# EAGLE design interface (EAGLE 6.1)

## Sheet 1 of 3
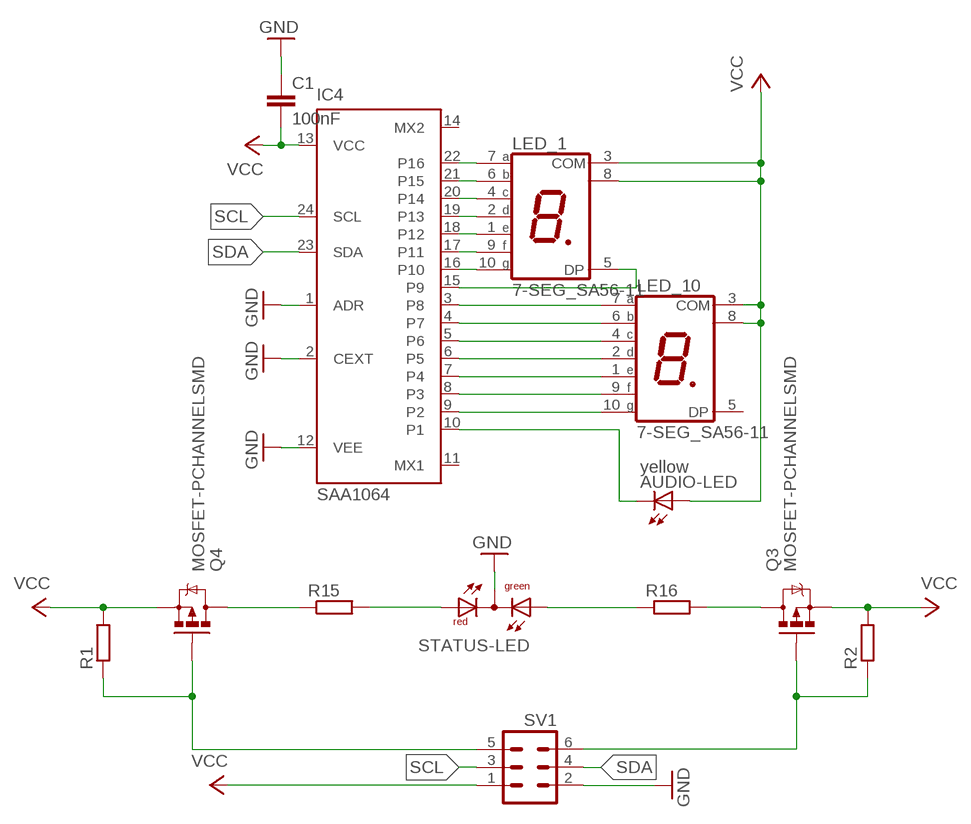
[diagram p0: schematic, sheet 1]

### Parts
AUDIO-LED  yellow  LED10MM  [LED10MM]
C1  100nF  C-EUC1206  [C1206]
IC4  SAA1064  [DIL24-6]
LED_1  7-SEG_SA56-11  [SA56-11]
LED_10  7-SEG_SA56-11  [SA56-11]
Q3  MOSFET-PCHANNELSMD  [SOT23-3]
Q4  MOSFET-PCHANNELSMD  [SOT23-3]
R1  R-EU_R1206  [R1206]
R2  R-EU_R1206  [R1206]
R15  R-EU_R1206  [R1206]
R16  R-EU_R1206  [R1206]
STATUS-LED  DUOLED-RG-C  [DUOLED-C-5MM]
SV1  ML6SMD2  [ML6_SMD2]

### Nets
GND: C1.1 IC4.1(ADR) IC4.2(CEXT) IC4.12(VEE) STATUS-LED.C SV1.2
N$1: IC4.17(P11) LED_1.9(F)
N$2: IC4.19(P13) LED_1.2(D)
N$3: IC4.21(P15) LED_1.6(B)
N$4: IC4.22(P16) LED_1.7(A)
N$5: IC4.20(P14) LED_1.4(C)
N$6: IC4.18(P12) LED_1.1(E)
N$7: IC4.16(P10) LED_1.10(G)
N$8: IC4.15(P9) LED_1.5(DP)
N$9: AUDIO-LED.K(C) IC4.10(P1)
N$10: IC4.3(P8) LED_10.7(A)
N$11: IC4.4(P7) LED_10.6(B)
N$12: IC4.5(P6) LED_10.4(C)
N$13: IC4.6(P5) LED_10.2(D)
N$14: IC4.7(P4) LED_10.1(E)
N$15: IC4.8(P3) LED_10.9(F)
N$16: IC4.9(P2) LED_10.10(G)
N$23: Q4.3(D) R15.1
N$24: Q3.3(D) R16.2
N$29: R15.2 STATUS-LED.AR
N$30: R16.1 STATUS-LED.AX(AG)
SCL: IC4.24(SCL) SV1.3
SDA: IC4.23(SDA) SV1.4
STATUS_GREEN: Q3.1(G) R2.1 SV1.6
STATUS_RED: Q4.1(G) R1.1 SV1.5
VCC: AUDIO-LED.A C1.2 IC4.13(VCC) LED_1.3(COM) LED_1.8(COM) LED_10.3(COM) LED_10.8(COM) Q3.2(S) Q4.2(S) R1.2 R2.2 SV1.1
Unconnected: IC4.11(MX1) IC4.14(MX2) LED_10.5(DP)

## Sheet 2 of 3
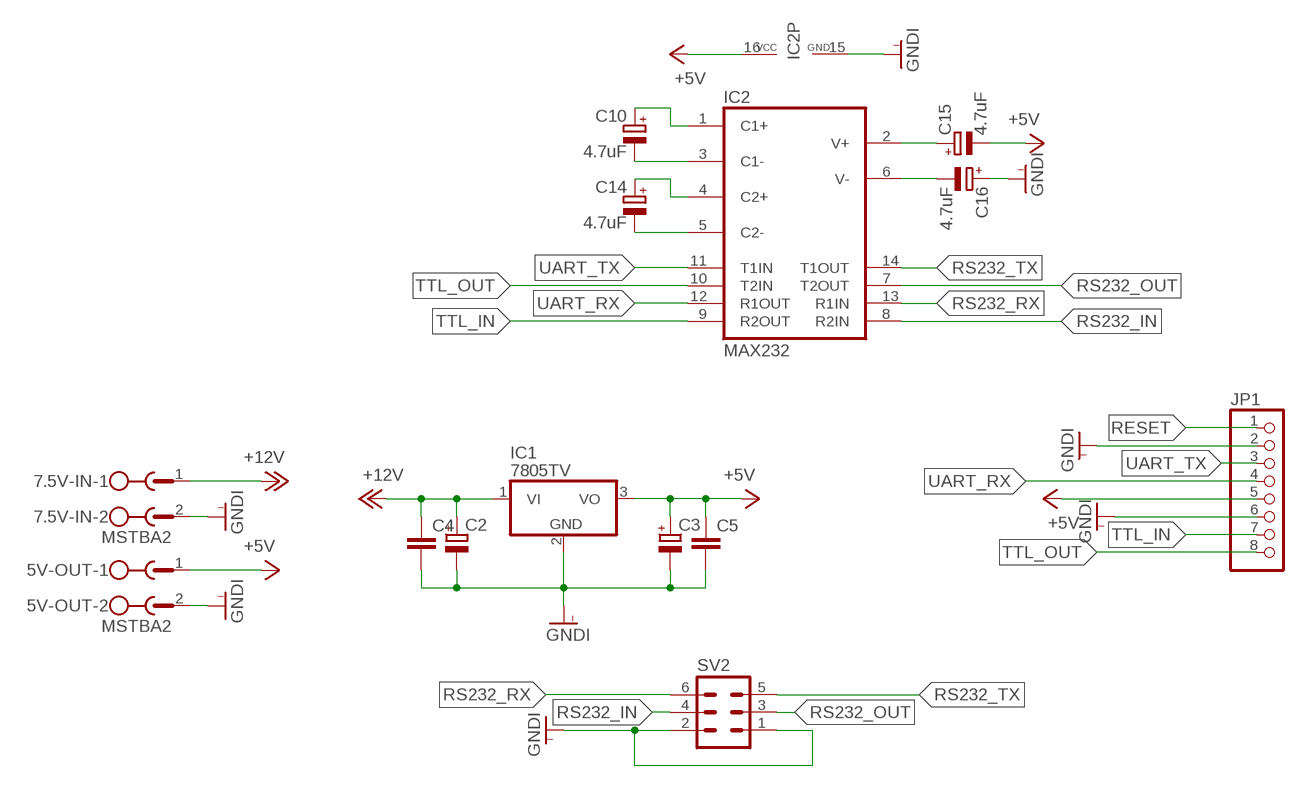
[diagram p1: schematic, sheet 2]

### Parts
5V-OUT  MSTBA2  [MSTBA2]
7.5V-IN  MSTBA2  [MSTBA2]
C2  CPOL-EUE5-10.5  [E5-10,5]
C3  CPOL-EUE5-10.5  [E5-10,5]
C4  C-EUC1206  [C1206]
C5  C-EUC1206  [C1206]
C10  4.7uF  CPOL-EUE2-5  [E2-5]
C14  4.7uF  CPOL-EUE2-5  [E2-5]
C15  4.7uF  CPOL-EUE2-5  [E2-5]
C16  4.7uF  CPOL-EUE2-5  [E2-5]
IC1  7805TV  [TO220V]
IC2  MAX232  [DIL16]
JP1  PINHD-1X8/90  [1X08/90]
SV2  ML6  [ML6]

### Nets
+5V: 5V-OUT.1 C3.+ C5.1 C15.- IC1.3(VO) IC2.16(VCC) JP1.5
+12V: 7.5V-IN.1 C2.+ C4.1 IC1.1(VI)
GNDI: 5V-OUT.2 7.5V-IN.2 C2.- C3.- C4.2 C5.2 C16.+ IC1.2(GND) IC2.15(GND) JP1.2 JP1.6 SV2.1 SV2.2
N$17: C14.+ IC2.4(C2+)
N$18: C14.- IC2.5(C2-)
N$19: C10.- IC2.3(C1-)
N$20: C10.+ IC2.1(C1+)
N$21: C16.- IC2.6(V-)
N$22: C15.+ IC2.2(V+)
RESET: JP1.1
RS232_IN: IC2.8(R2IN) SV2.4
RS232_OUT: IC2.7(T2OUT) SV2.3
RS232_RX: IC2.13(R1IN) SV2.6
RS232_TX: IC2.14(T1OUT) SV2.5
TTL_IN: IC2.9(R2OUT) JP1.7
TTL_OUT: IC2.10(T2IN) JP1.8
UART_RX: IC2.12(R1OUT) JP1.4
UART_TX: IC2.11(T1IN) JP1.3

## Sheet 3 of 3
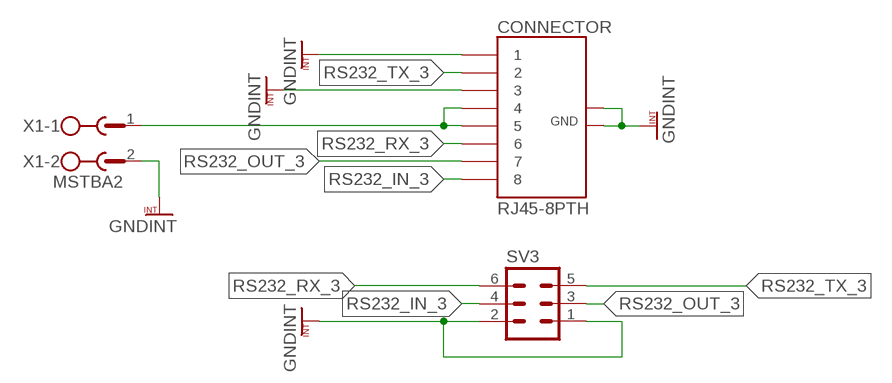
[diagram p2: schematic, sheet 3]

### Parts
CONNECTOR  RJ45-8PTH  [RJ45-8]
SV3  ML6  [ML6]
X1  MSTBA2  [MSTBA2]

### Nets
GNDINT: CONNECTOR.1 CONNECTOR.3 CONNECTOR.GND_1 CONNECTOR.GND_2 SV3.1 SV3.2 X1.2
RS232_IN_3: CONNECTOR.8 SV3.4
RS232_OUT_3: CONNECTOR.7 SV3.3
RS232_RX_3: CONNECTOR.6 SV3.6
RS232_TX_3: CONNECTOR.2 SV3.5
V_BAT: CONNECTOR.4 CONNECTOR.5 X1.1

## Library data of the parts
5V-OUT 7.5V-IN X1 = con-phoenix-508:MSTBA2: PHOENIX; MF: FARNELL; MPN: 1757242; OC_FARNELL: 3705171; OC_NEWARK: 71C4161
AUDIO-LED = led:LED: LED OSRAM: - CHIPLED LG R971, LG N971, LY N971, LG Q971, LY Q971, LO R971, LY R971 LH N974, LH R974 LS Q976, LO Q976, LY Q976 LO Q996 - Hyper CHIPLED LW Q18S LB Q993, LB Q99A, LB R99A - SideLED LS A670, LO A670, LY A670, LG A670, LP A670 LB A673, LV A673, LT A673, LW A673 LH A674 LY A675 LS A676, LA A676, LO A676, LY A676, LW A676 LS A679, LY A679, LG A679 - Hyper Micro SIDELED® LS Y876, LA Y876, LO Y876, LY Y876 LT Y87S - SmartLED LW L88C, LW L88S LB L89C, LB L89S, LG L890 LS L89K, LO L89K, LY L89K LS L896, LA L896, LO L896, LY L896 - TOPLED LS T670, LO T670, LY T670, LG T670, LP T670 LSG T670, LSP T670, LSY T670, LOP T670, LYG T670 LG T671, LOG T671, LSG T671 LB T673, LV T673, LT T673, LW T673 LH T674 LS T676, LA T676, LO T676, LY T676, LB T676, LH T676, LSB T676, LW T676 LB T67C, LV T67C, LT T67C, LS T67K, LO T67K, LY T67K, LW E67C LS E67B, LA E67B, LO E67B, LY E67B, LB E67C, LV E67C, LT E67C LW T67C LS T679, LY T679, LG T679 LS T770, LO T770, LY T770, LG T770, LP T770 LB T773, LV T773, LT T773, LW T773 LH T774 LS E675, LA E675, LY E675, LS T675 LS T776, LA T776, LO T776, LY T776, LB T776 LHGB T686 LT T68C, LB T68C - Hyper Mini TOPLED® LB M676 - Mini TOPLED Santana® LG M470 LS M47K, LO M47K, LY M47K Source: http://www.osram.convergy.de LUXEON: - LUMILED® LXK2-PW12-R00, LXK2-PW12-S00, LXK2-PW14-U00, LXK2-PW14-V00 LXK2-PM12-R00, LXK2-PM12-S00, LXK2-PM14-U00 LXK2-PE12-Q00, LXK2-PE12-R00, LXK2-PE12-S00, LXK2-PE14-T00, LXK2-PE14-U00 LXK2-PB12-K00, LXK2-PB12-L00, LXK2-PB12-M00, LXK2-PB14-N00, LXK2-PB14-P00, LXK2-PB14-Q00 LXK2-PR12-L00, LXK2-PR12-M00, LXK2-PR14-Q00, LXK2-PR14-R00 LXK2-PD12-Q00, LXK2-PD12-R00, LXK2-PD12-S00 LXK2-PH12-R00, LXK2-PH12-S00 LXK2-PL12-P00, LXK2-PL12-Q00, LXK2-PL12-R00 Source: www.luxeon.com KINGBRIGHT: KA-3528ASYC Source: www.kingbright.com
C1 C4 C5 = resistor:C-EU: CAPACITOR, European symbol
C2 C3 C10 C14-C16 = resistor:CPOL-EU: POLARIZED CAPACITOR, European symbol
CONNECTOR = ShortCircuitRobotics:RJ45-8: RJ45 Jack Simple RJ45, 8-pin connection - connector for common Cat5, Cat5e, and Cat6 Ethernet cables. Footprint not yet proven in production. Connector sku is PRT-00643; Breakout PCB sku is BOB-00716.
IC1 = linear:78*: Positive VOLTAGE REGULATOR Source: http://cache.national.com/ds/LM/LM78L05.pdf http://www.fairchildsemi.com/ds/LM/LM7805.pdf
IC2 = maxim:MAX232: RS232 TRANSEIVER; MF: MAXIM; MPN: MAX232ACPE+; OC_FARNELL: 9723773; OC_NEWARK: 68K4544
IC4 = micro-philips:SAA1064: I2C-Bus 4-digit LED-DRIVER; MPN: SAA1064/N2,112; OC_FARNELL: 1627002; OC_NEWARK: 70R8646
JP1 = pinhead:PINHD-1X8: PIN HEADER
LED_1 LED_10 = display-kingbright:7-SEG_: Kingbright 14.2mm (0.56 INCH) SINGLE DIGIT NUMERIC DUISPLAY Source: SA56-11EWA(Ver1189471036.pdf; OC_FARNELL: unknown; OC_NEWARK: unknown
Q3 Q4 = SparkFun:MOSFET-PCHANNEL
R1 R2 R15 R16 = resistor:R-EU_: RESISTOR, European symbol
STATUS-LED = led:DUOLED-RG-C: DUO LED 2 colors (red/green), 5 mm, round, common Cathode www.ligitek.com or other producers.
SV1 = ShortCircuitRobotics:ML6: HARTING
SV2 SV3 = con-harting-ml:ML6: HARTING; OC_FARNELL: unknown; OC_NEWARK: unknown

## Board
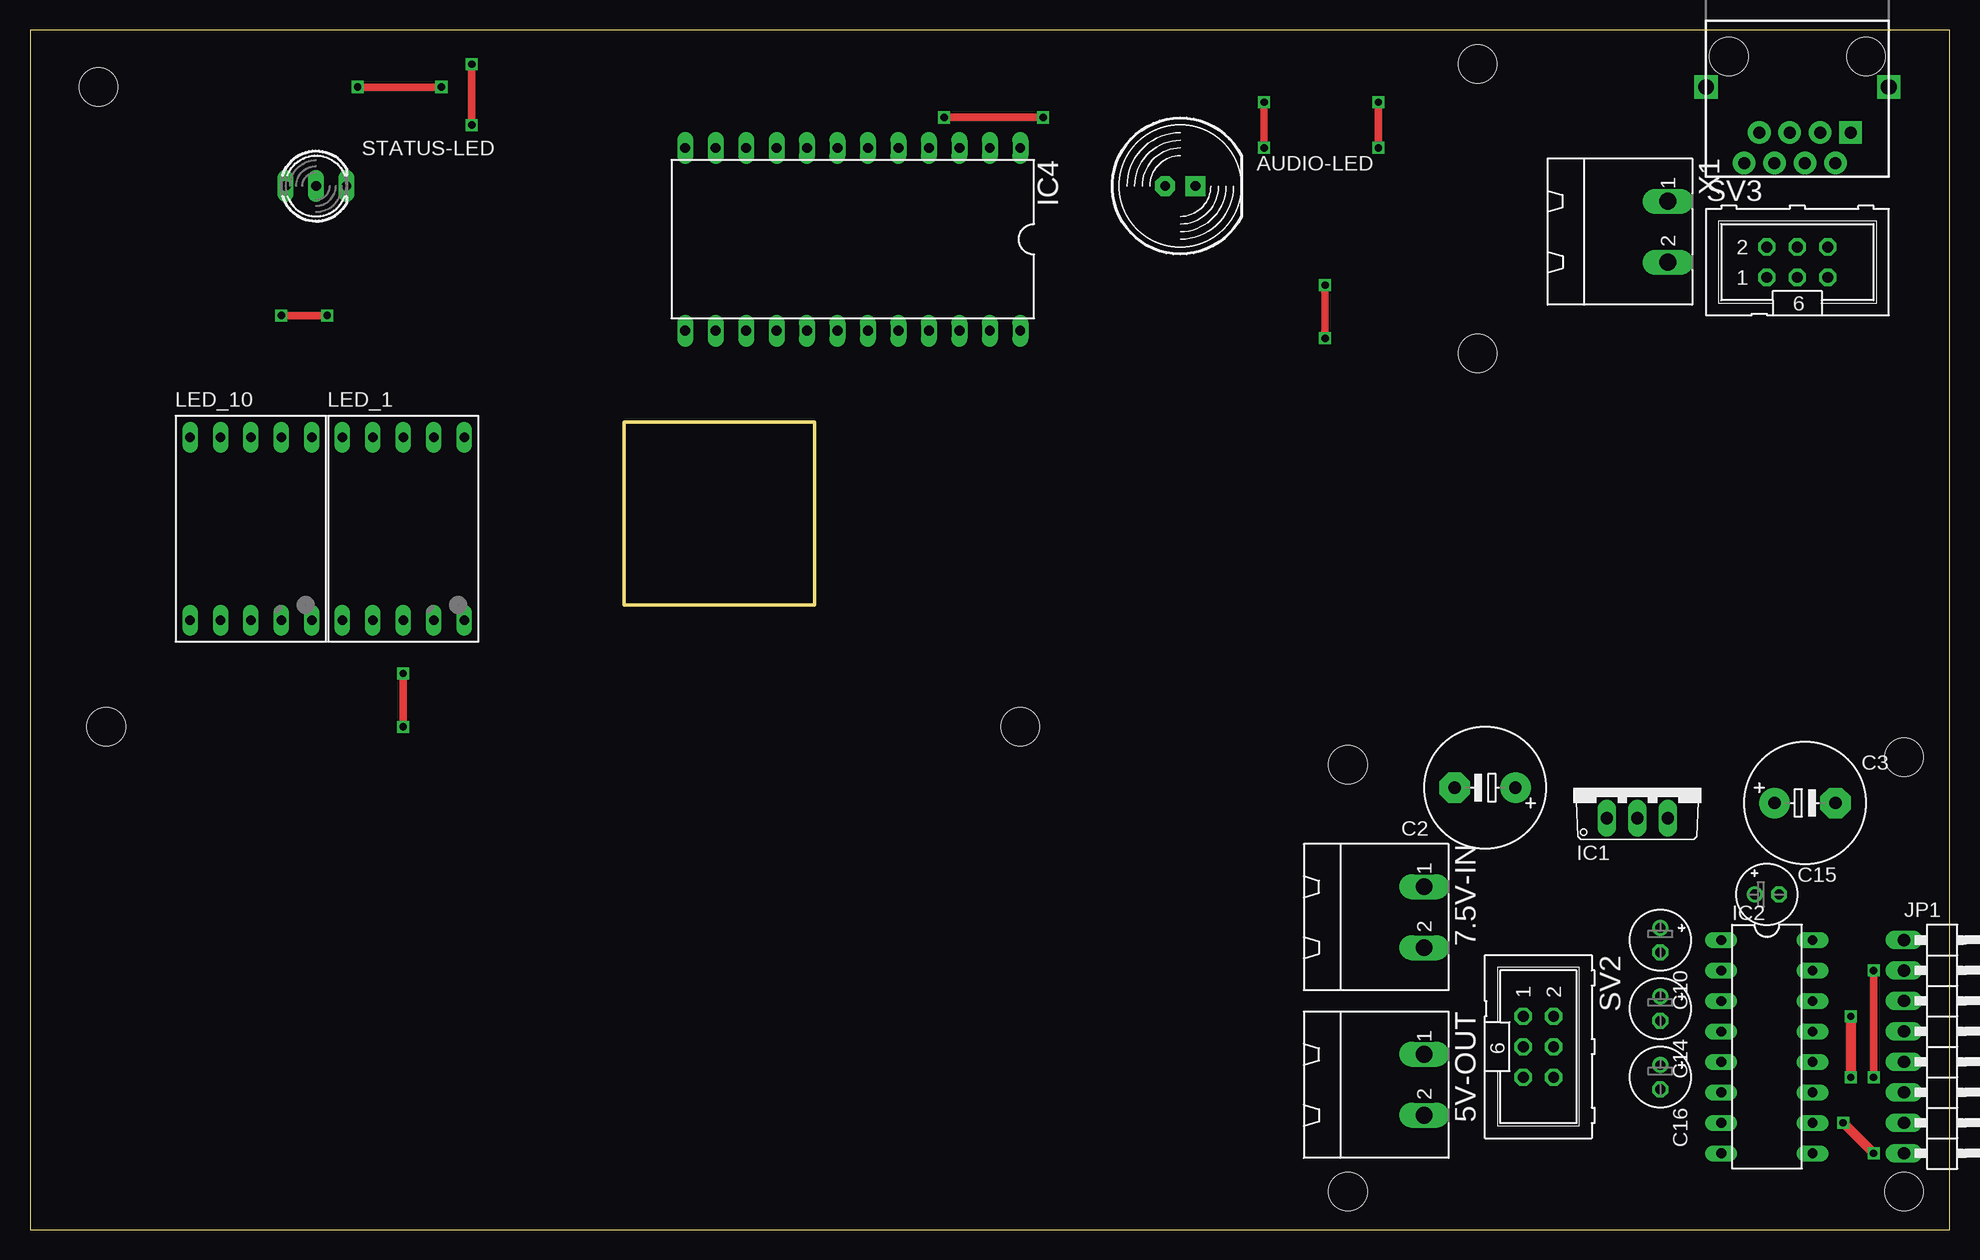
[diagram p3: board, top side]
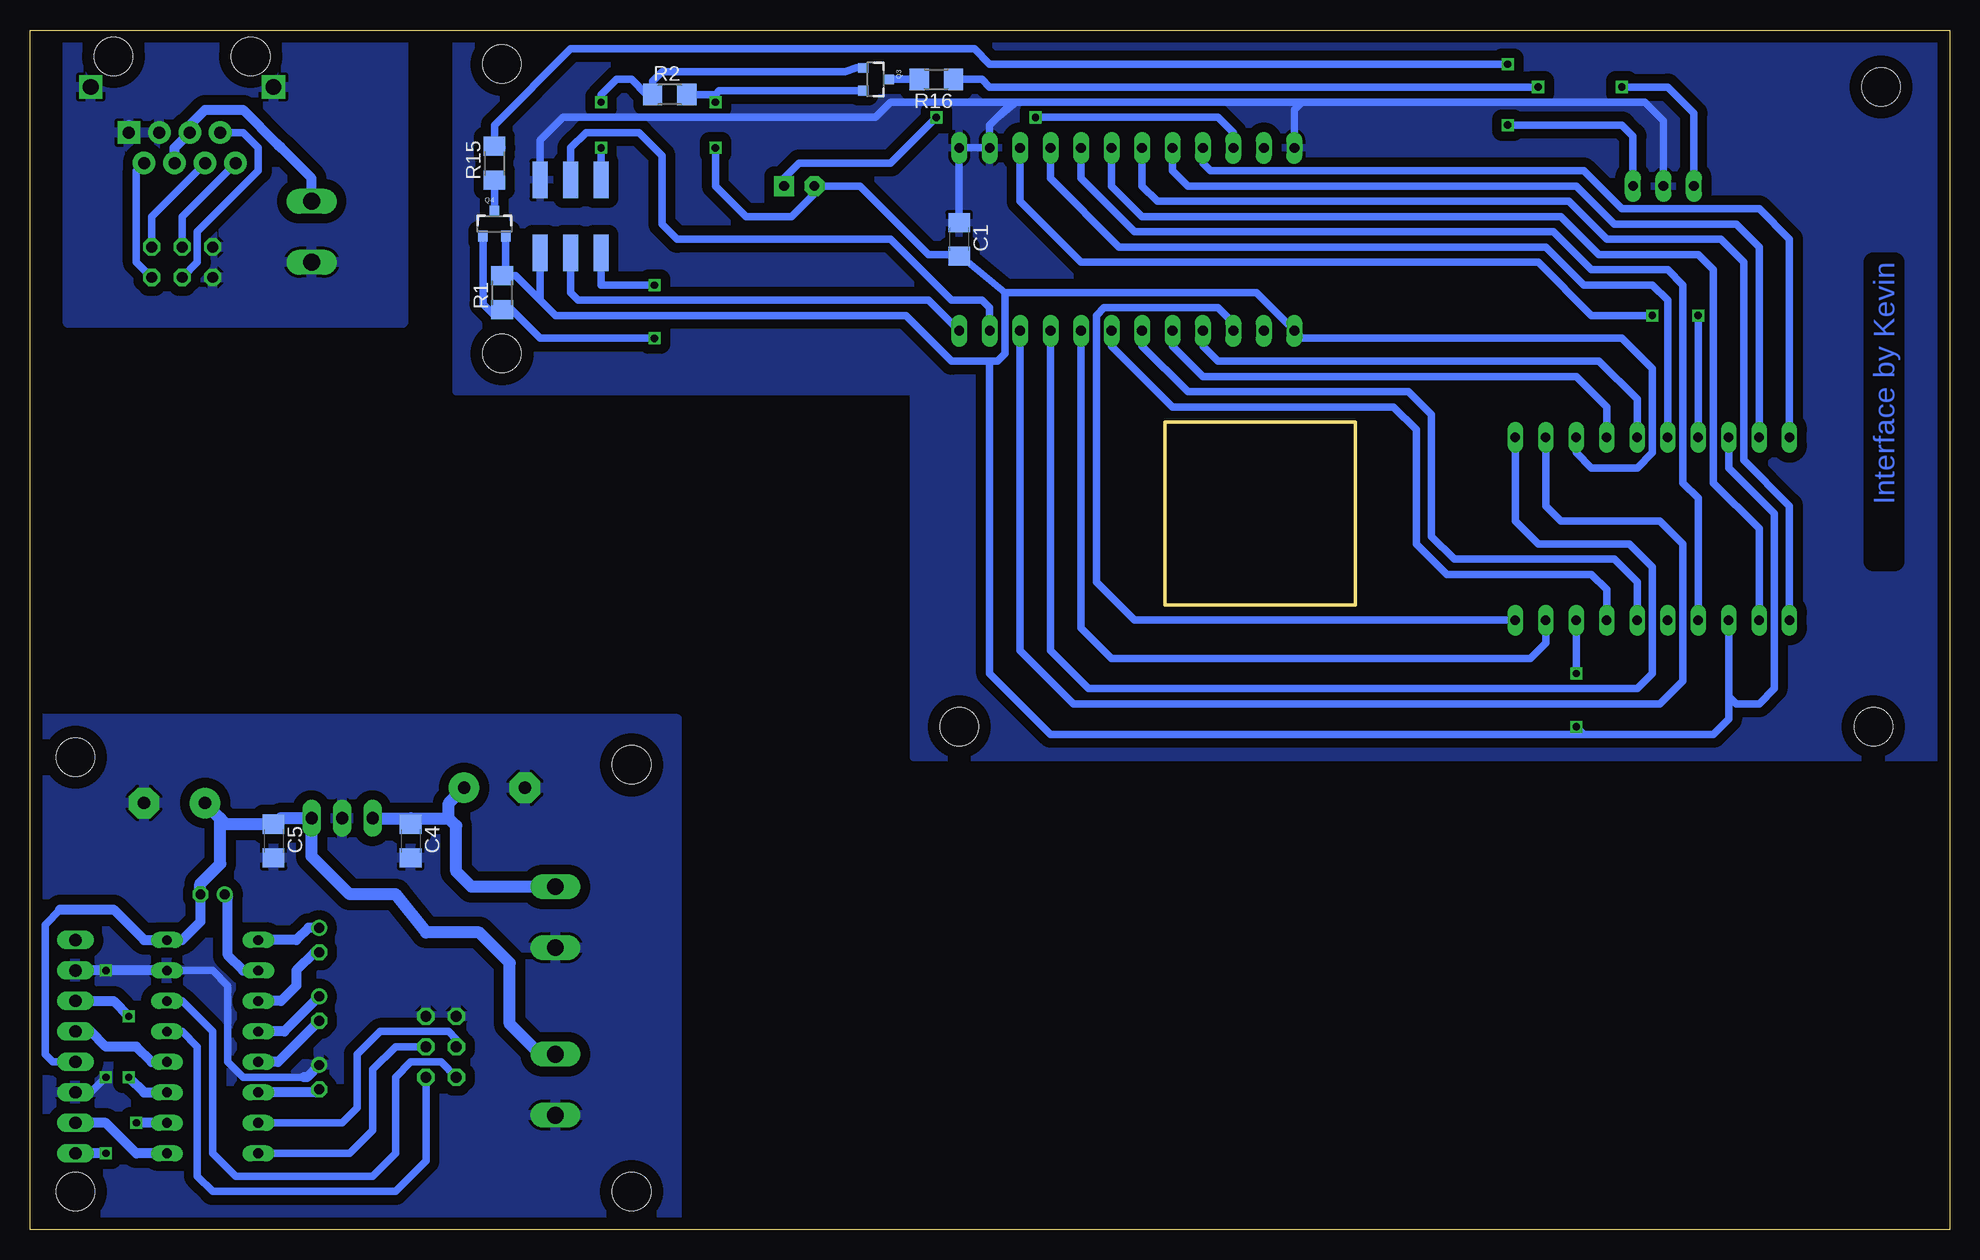
[diagram p4: board, bottom side, seen from below]

Size 160 x 100 mm. Coordinates in mm from the lower left corner, seen from the top.
Outline: 0,0 160,0 160,100 0,100 0,0
Copper layers (1*16): Top 0.035mm / dielectric 1.5mm / Bottom 0.035mm
Design rules: minimum track width 10mil, minimum drill 24mil, track to track 8mil, track to pad 8mil, pad to pad 8mil, via to via 8mil, smd to smd 8mil, copper to edge 40mil, drill to drill 8mil, minimum pad ring 10mil, minimum via ring 8mil, stop-mask expansion 4mil, vias tented up to drill 0mil, thermal gap 10mil
Holes 3.2 mm at 109.86,38.73 156.21,39.37 156.21,3.17 109.86,3.17 5.71,95.25 6.35,41.91 82.55,41.91 120.65,97.16 120.65,73.03
Milling: 4 lines

### Footprints (pad centres in the part's own frame; a part is rotated, then mirrored left to right if it is on the bottom)
MSTBA2 = drill 1.397 long: 1 -2.54,5.08; 2 2.54,5.08
LED10MM = drill 0.813 pad 1.676 octagon: A -1.27,0 | drill 0.813 pad 1.676 square: K 1.27,0
C1206 = smd 1.6 x 1.8: 1 -1.4,0; 2 1.4,0
E5-10,5 = drill 1.016 pad 2.54: + -2.54,0 | drill 1.016 pad 2.54 octagon: - 2.54,0
E2-5 = drill 0.813 pad 1.27: + -1.016,0 | drill 0.813 pad 1.27 octagon: - 1.016,0
RJ45-8 = drill 1 pad 1.88 square: 1 -4.445,6.35 | drill 1 pad 1.88: 2 -3.175,8.89; 3 -1.905,6.35; 4 -0.635,8.89; 5 0.635,6.35; 6 1.905,8.89; 7 3.175,6.35; 8 4.445,8.89 | drill 1.3 square: GND_1 -7.62,2.54; GND_2 7.62,2.54 | hole 3.2: -5.715,0; 5.715,0
TO220V = drill 1.016 long: 1 -2.54,-2.54; 2 0,-2.54; 3 2.54,-2.54
DIL16 = drill 0.813 long: 1 -8.89,-3.81; 2 -6.35,-3.81; 3 -3.81,-3.81; 4 -1.27,-3.81; 5 1.27,-3.81; 6 3.81,-3.81; 7 6.35,-3.81; 8 8.89,-3.81; 9 8.89,3.81; 10 6.35,3.81; 11 3.81,3.81; 12 1.27,3.81; 13 -1.27,3.81; 14 -3.81,3.81; 15 -6.35,3.81; 16 -8.89,3.81
DIL24-6 = drill 0.813 long: 1 -13.97,-7.62; 2 -11.43,-7.62; 3 -8.89,-7.62; 4 -6.35,-7.62; 5 -3.81,-7.62; 6 -1.27,-7.62; 7 1.27,-7.62; 8 3.81,-7.62; 9 6.35,-7.62; 10 8.89,-7.62; 11 11.43,-7.62; 12 13.97,-7.62; 13 13.97,7.62; 14 11.43,7.62; 15 8.89,7.62; 16 6.35,7.62; 17 3.81,7.62; 18 1.27,7.62; 19 -1.27,7.62; 20 -3.81,7.62; 21 -6.35,7.62; 22 -8.89,7.62; 23 -11.43,7.62; 24 -13.97,7.62
1X08/90 = drill 1.016 long: 1 -8.89,-3.81; 2 -6.35,-3.81; 3 -3.81,-3.81; 4 -1.27,-3.81; 5 1.27,-3.81; 6 3.81,-3.81; 7 6.35,-3.81; 8 8.89,-3.81
SA56-11 = drill 0.8 long: 1 -5.08,-7.62; 2 -2.54,-7.62; 3 0,-7.62; 4 2.54,-7.62; 5 5.08,-7.62; 6 5.08,7.62; 7 2.54,7.62; 8 0,7.62; 9 -2.54,7.62; 10 -5.08,7.62
SOT23-3 = smd 0.8 x 0.9: 1 -0.95,-1; 2 0.95,-1; 3 0,1.1
R1206 = smd 1.6 x 1.803: 1 -1.422,0; 2 1.422,0
DUOLED-C-5MM = drill 0.813 long: AR 2.54,0; AX -2.54,0; C 0,0
ML6_SMD2 = smd 1.27 x 3.048: 1 -2.54,-3.048; 2 -2.54,3.048; 3 0,-3.048; 4 0,3.048; 5 2.54,-3.048; 6 2.54,3.048
ML6 = drill 0.914 octagon: 1 -2.54,-1.27; 2 -2.54,1.27; 3 0,-1.27; 4 0,1.27; 5 2.54,-1.27; 6 2.54,1.27

### Placement (x,y rotation side)
5V-OUT  111.12,12.06 270 top
7.5V-IN  111.12,26.04 270 top
AUDIO-LED  95.89,87 0 top
C1  82.55,82.55 270 bottom
C2  121.28,36.83 180 top
C3  147.96,35.56 0 top
C4  128.27,32.38 270 bottom
C5  139.7,32.38 270 bottom
C10  135.89,24.13 270 top
C14  135.89,18.41 270 top
C15  144.78,27.94 0 top
C16  135.89,12.7 270 top
CONNECTOR  147.32,97.79 180 top
IC1  133.99,36.83 0 top
IC2  144.78,15.24 270 top
IC4  68.58,82.55 180 top
JP1  160.02,15.24 270 top
LED_1  31.11,58.42 0 top
LED_10  18.41,58.42 0 top
Q3  89.53,95.89 270 bottom
Q4  121.28,83.82 0 bottom
R1  120.65,78.11 90 bottom
R2  106.68,94.61 0 bottom
R15  121.28,88.9 90 bottom
R16  84.45,95.89 180 bottom
STATUS-LED  23.84,87 0 top
SV1  114.94,84.45 0 bottom
SV2  125.73,15.24 270 top
SV3  147.32,80.64 0 top
X1  131.44,83.19 270 top

### Tracks (layer width: path | path; a pad name or v marks a point on that pad's centre or on a via)
+5V
  Bottom 0.61: JP1.5 158.12,13.97 158.75,14.61 158.75,25.4 157.48,26.67
  Bottom 0.813: C15.- 145.8,25.65 147.32,24.13 IC2.16 150.5,24.13 153.03,26.67 157.48,26.67
  Bottom 1.016: 5V-OUT.1 117.47,14.61 120.02,17.14 120.02,22.23 122.56,24.77 127,24.77 129.54,27.94 133.35,27.94 136.53,31.11 IC1.3 139.06,34.29 139.7,33.66 C5.1 143.64,33.78 144.15,34.29 | C15.- 145.8,28.83 144.15,30.48 144.15,34.29 | 144.15,34.29 C3.+
+12V
  Bottom 1.016: 7.5V-IN.1 123.19,28.57 124.46,29.84 124.46,33.66 125.09,34.29 | IC1.1 128.27,34.29 | 128.27,34.29 125.09,34.29 | C4.1 128.27,34.29 | 125.09,34.29 125.09,35.56 C2.+
GND
  Bottom 0.61: C1.1 IC4.1 IC4.2 80.01,92.08 79.69,92.39 | STATUS-LED.C 23.84,92.42 25.4,93.98 53.98,93.98 | 53.98,93.98 54.61,93.34 IC4.12 | 79.69,92.39 78.11,93.98 | 78.11,93.98 77.79,93.98 | 77.79,93.98 53.98,93.98 | SV1.2 117.47,90.81 115.57,92.71 89.53,92.71 88.27,93.98 78.11,93.98 | 77.79,93.98 79.69,92.39
  pour Bottom (isolate 0.813): 0,100.33 124.46,100.33 124.46,69.85 86.36,69.85 86.36,39.37 0,39.37
GNDI  (via drill 0.6)
  Top 0.61: v153.67,12.7 v153.67,21.59
  Bottom 0.61: 137.16,12.7 142.24,12.7 143.51,13.97 143.51,20.32 144.78,21.59 IC2.15 | JP1.6 154.94,11.43 v153.67,12.7
  Bottom 0.813: C16.+ 136.91,12.7 137.16,12.7 | IC2.15 v153.67,21.59 JP1.2
  pour Bottom (isolate 0.813): 106.05,0 106.05,42.55 160.02,42.55 160.02,0
GNDINT
  Bottom 0.813: CONNECTOR.1 151.76,92.08
  pour Bottom (isolate 0.813): 128.91,99.69 128.91,75.56 156.84,75.56 156.84,99.69
N$1
  Bottom 0.61: IC4.17 64.77,73.66 62.23,71.12 31.11,71.12 28.57,68.58 LED_1.9
N$2
  Bottom 0.61: LED_1.2 28.57,53.34 29.84,54.61 41.91,54.61 44.45,57.15 44.45,66.67 46.35,68.58 64.77,68.58 69.85,73.66 IC4.19
N$3
  Bottom 0.61: LED_1.6 36.2,59.05 34.29,57.15 26.67,57.15 24.77,55.24 24.77,46.35 26.04,45.09 71.75,45.09 74.93,48.26 IC4.21
N$4
  Bottom 0.61: IC4.22 77.47,48.26 73.98,44.77 73.66,44.45 73.03,43.81 24.13,43.81 22.23,45.72 22.23,57.15 24.13,59.05 32.38,59.05 33.66,60.33 LED_1.7
N$5
  Bottom 0.61: LED_1.4 33.66,48.9 34.92,47.62 69.85,47.62 72.39,50.16 IC4.20
N$6
  Bottom 0.61: LED_1.1 26.04,53.98 27.94,55.88 41.27,55.88 43.18,57.78 43.18,67.94 45.09,69.85 63.5,69.85 67.31,73.66 IC4.18
N$7
  Bottom 0.61: LED_1.10 26.04,69.22 29.21,72.39 60.96,72.39 62.23,73.66 IC4.16
N$8
  Bottom 0.61: LED_1.5 67.94,50.8 71.12,53.98 71.12,76.2 70.48,76.83 60.96,76.83 59.69,75.56 IC4.15
N$9  (via drill 0.6)
  Top 0.61: v76.2,92.71 v84.45,92.71
  Bottom 0.61: IC4.10 59.69,91.44 60.96,92.71 v76.2,92.71 | v84.45,92.71 88.27,88.9 95.89,88.9 97.16,87.63 AUDIO-LED.K
N$10  (via drill 0.6)
  Top 0.61: v20.95,76.2 v24.77,76.2
  Bottom 0.61: LED_10.7 v20.95,76.2 | IC4.3 77.47,85.72 72.39,80.64 34.29,80.64 29.84,76.2 v24.77,76.2
N$11
  Bottom 0.61: LED_10.6 23.5,77.47 24.77,78.74 30.48,78.74 33.66,81.92 69.22,81.92 74.93,87.63 IC4.4
N$12
  Bottom 0.61: LED_10.4 20.95,60.96 22.23,62.23 22.23,78.74 23.5,80.01 29.84,80.01 33.02,83.19 67.94,83.19 72.39,87.63 IC4.5
N$13
  Bottom 0.61: LED_10.2 15.88,58.42 19.68,62.23 19.68,80.01 20.95,81.28 29.21,81.28 32.38,84.45 67.31,84.45 69.85,87 IC4.6
N$14
  Bottom 0.61: LED_10.1 13.34,60.33 17.14,64.14 17.14,80.64 19.05,82.55 28.57,82.55 31.75,85.72 66.04,85.72 67.31,87 IC4.7
N$15
  Bottom 0.61: IC4.8 64.77,88.27 63.5,87 31.11,87 27.94,83.82 17.78,83.82 15.88,81.92 LED_10.9
N$16
  Bottom 0.61: IC4.9 62.23,88.9 61.59,88.27 30.48,88.27 27.3,85.09 15.88,85.09 13.34,82.55 LED_10.10
N$17
  Bottom 0.813: C14.+ 138.81,16.51 IC2.4
N$18
  Bottom 0.813: C14.- 139.32,13.97 IC2.5
N$19
  Bottom 0.813: IC2.3 139.06,19.05 137.79,20.32 137.79,21.59 136.27,23.11 C10.-
N$20
  Bottom 0.813: C10.+ 136.78,25.15 137.79,24.13 IC2.1
N$21
  Bottom 0.813: C16.- 136.14,11.43 IC2.6
N$22
  Bottom 0.813: IC2.2 142.24,21.59 143.51,22.86 143.51,27.69 C15.+
N$23
  Bottom 0.61: Q4.3 R15.1 121.28,87.63
N$24
  Bottom 0.61: R16.2 Q3.3
N$29  (via drill 0.6)
  Top 0.61: v36.83,92.08 v36.83,97.16
  Bottom 0.61: STATUS-LED.AR 26.39,91.16 27.3,92.08 v36.83,92.08 | v36.83,97.16 80.01,97.16 81.28,98.42 114.94,98.42 121.28,92.08 R15.2 120.65,90.17
N$30  (via drill 0.6)
  Top 0.61: v34.29,95.25 v27.3,95.25
  Bottom 0.61: STATUS-LED.AX 21.3,93.06 23.5,95.25 v27.3,95.25 | R16.1 80.64,95.89 80.01,95.25 v34.29,95.25
RS232_IN
  Bottom 0.61: IC2.8 133.35,6.35 131.44,8.26 131.44,13.34 129.54,15.24 SV2.4
RS232_IN_3
  Bottom 0.61: SV3.4 147.32,84.45 CONNECTOR.8
RS232_OUT
  Bottom 0.61: SV2.3 124.46,15.88 125.09,16.51 130.81,16.51 132.72,14.61 132.72,10.16 133.99,8.89 IC2.7
RS232_OUT_3
  Bottom 0.61: SV3.3 146.05,80.64 146.05,83.19 140.97,88.27 140.97,90.17 142.24,91.44 CONNECTOR.7
RS232_RX
  Bottom 0.61: IC2.13 147.32,16.51 146.05,15.24 146.05,4.45 144.78,3.17 129.54,3.17 127,5.71 SV2.6
RS232_RX_3
  Bottom 0.61: SV3.6 149.86,84.45 CONNECTOR.6
RS232_TX
  Bottom 0.61: IC2.14 147.32,19.05 144.78,16.51 144.78,6.35 142.88,4.45 131.44,4.45 129.54,6.35 129.54,12.7 128.27,13.97 125.73,13.97 SV2.5
RS232_TX_3
  Bottom 0.61: SV3.5 151.13,80.64 151.13,88.27 CONNECTOR.2
SCL
  Bottom 0.61: SV1.3 114.94,78.11 114.3,77.47 85.09,77.47 IC4.24
SDA
  Bottom 0.61: IC4.23 80.01,76.83 80.64,77.47 83.19,77.47 88.27,82.55 106.05,82.55 107.31,83.82 107.31,89.53 109.22,91.44 113.67,91.44 114.94,90.17 SV1.4
STATUS_GREEN  (via drill 0.6)
  Top 0.61: v112.39,90.17 v112.39,93.98
  Bottom 0.61: SV1.6 v112.39,90.17 | v112.39,93.98 112.39,94.61 111.12,95.89 109.86,95.89 108.58,94.61 R2.1 108.1,95.73 107.31,96.52 92.08,96.52 91.12,96.83 Q3.1
STATUS_RED  (via drill 0.6)
  Top 0.61: v107.95,74.3 v107.95,78.74
  Bottom 0.61: Q4.1 122.23,77.15 121.28,76.2 121.13,76.2 R1.1 119.86,76.68 117.47,74.3 v107.95,74.3 | v107.95,78.74 112.39,78.74 SV1.5
TTL_IN
  Bottom 0.813: IC2.9 151.13,6.35 153.67,8.89 JP1.7
TTL_OUT  (via drill 0.6)
  Top 0.813: v151.13,8.89 v153.67,6.35
  Bottom 0.813: IC2.10 v151.13,8.89 | v153.67,6.35 JP1.8
UART_RX
  Bottom 0.813: IC2.12 149.86,13.97 151.13,15.24 153.67,15.24 154.94,16.51 JP1.4
UART_TX  (via drill 0.6)
  Top 0.813: v151.76,17.78 v151.76,12.7
  Bottom 0.813: JP1.3 153.03,19.05 v151.76,17.78 | v151.76,12.7 150.5,11.43 IC2.11
V_BAT
  Bottom 0.813: CONNECTOR.4 147.96,90.17 CONNECTOR.5 146.69,92.08 145.41,93.34 142.24,93.34 139.38,90.49 139.06,90.17 136.53,87.63 X1.1
VCC  (via drill 0.6)
  Top 0.61: v31.11,41.91 v31.11,46.35 | v102.87,90.17 v102.87,93.98
  Bottom 0.61: LED_1.8 31.11,64.77 29.84,63.5 26.04,63.5 24.77,64.77 24.77,71.75 27.3,74.3 53.98,74.3 IC4.13 57.78,78.11 78.74,78.11 | LED_10.3 18.41,44.45 | 30.48,41.27 19.68,41.27 18.41,42.55 18.41,44.45 | 30.48,41.27 v31.11,41.91 | v31.11,46.35 LED_1.3 | 78.74,78.11 82.55,81.28 | 80.01,72.39 79.38,72.39 78.74,73.03 78.74,78.11 | LED_10.8 18.41,63.5 14.61,59.69 14.61,45.09 15.88,43.81 17.78,43.81 18.41,44.45 | 30.48,41.27 74.93,41.27 80.01,46.35 80.01,72.39 | 82.55,81.28 85.09,81.28 90.81,87 AUDIO-LED.A 94.61,86.36 96.52,84.45 100.33,84.45 102.87,87 v102.87,90.17 | C1.2 82.55,81.28 | 80.01,72.39 83.19,72.39 87,76.2 116.2,76.2 117.47,77.47 | 117.47,77.47 SV1.1 | 117.47,77.47 119.53,79.53 R1.2 120.33,79.84 Q4.2 | v102.87,93.98 102.87,94.61 | 102.87,94.61 R2.2 105.41,94.61 | Q3.2 102.55,94.94 102.87,94.61

### Text on the board
Bottom: Interface by Kevin